# Altium schematic sheet TD.0002-100_1.SchDoc: ДТТ-1
size 420 x 297 mm; ApprovedBy: Маханов; CheckedBy: Айкеева; Organization: РЭТ-41; SheetNumber: 1; SheetTotal: 3; ProcessInspection: Айкеева; NormInspection: Мухамедрах.
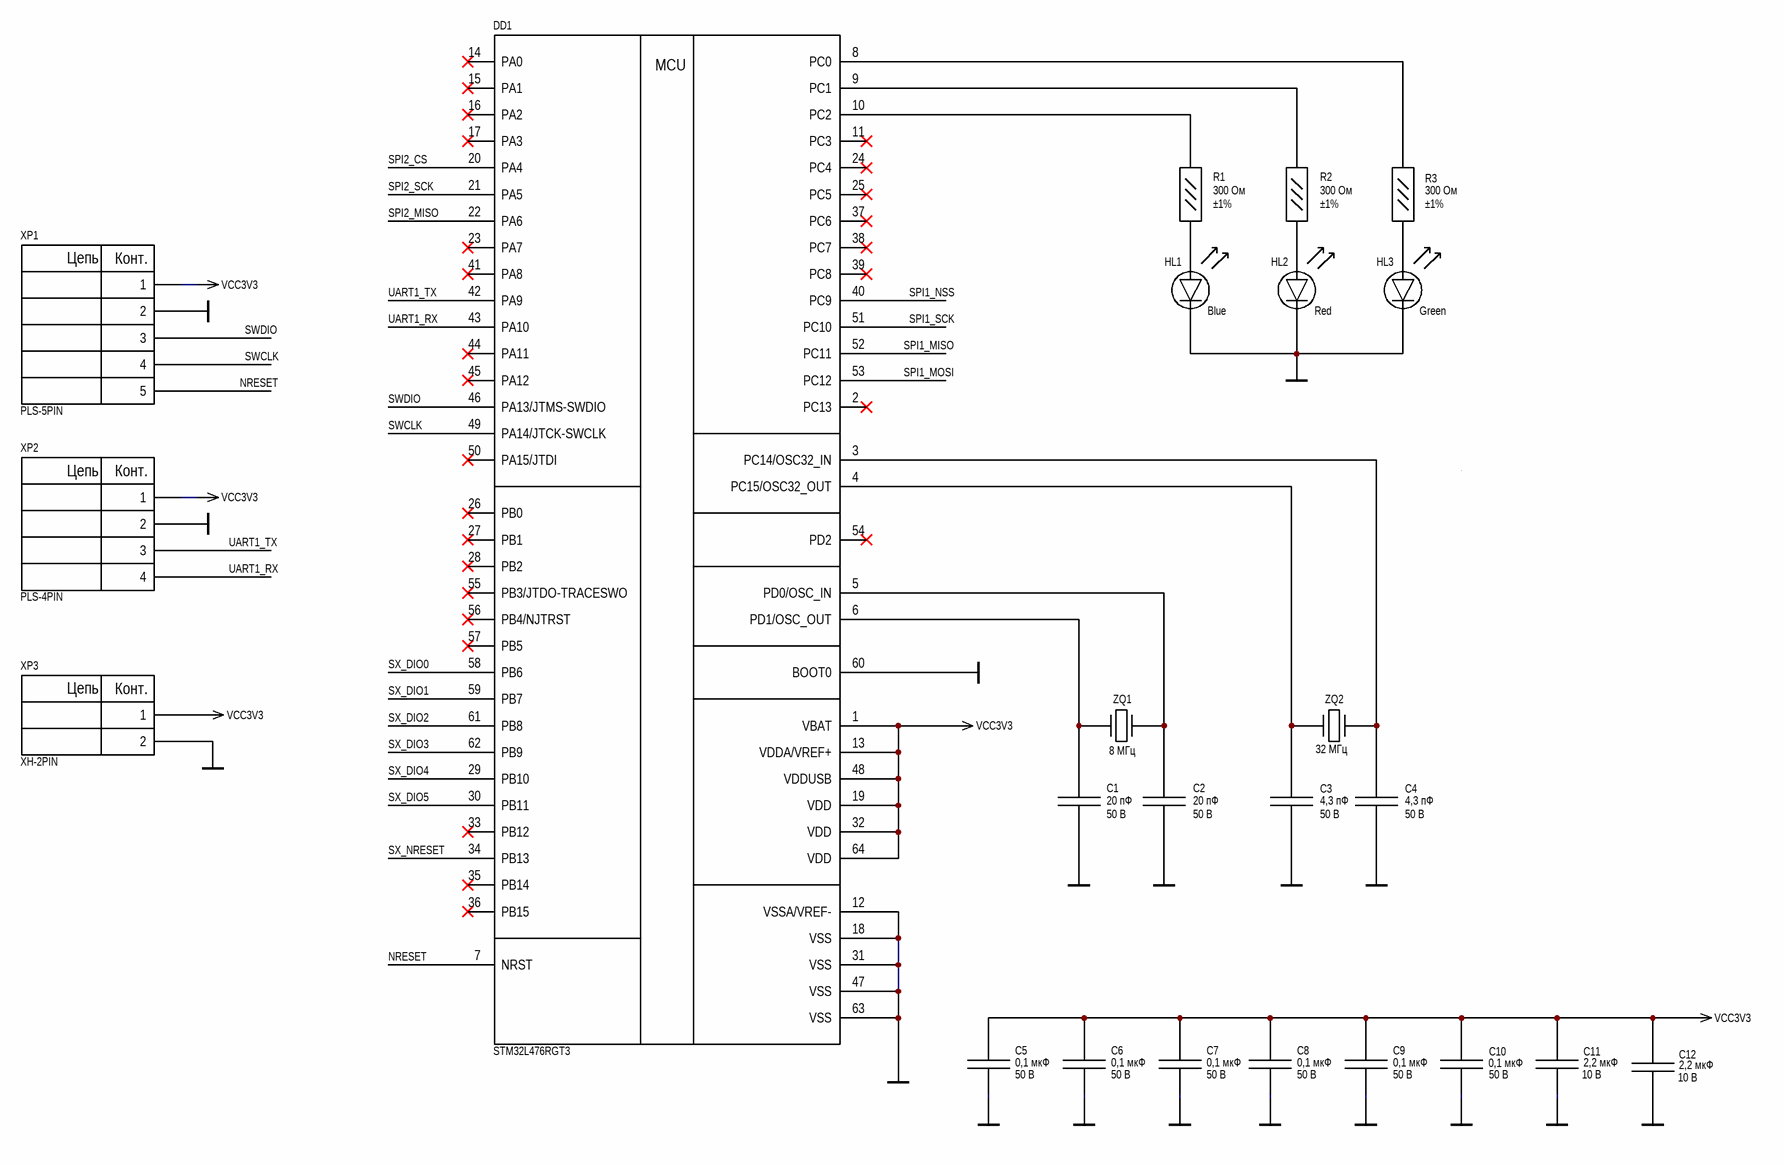
[diagram p0: TD.0002-100_1.SchDoc]

## Parts
C1  value 20 пФ  Voltage: 50 В  [C_0402]  (hidden comment: GCM1555C1H200JA16)
C2  value 20 пФ  Voltage: 50 В  [C_0402]  (hidden comment: GCM1555C1H200JA16)
C3  value 4,3 пФ  Voltage: 50 В  [C_0402]  (hidden comment: GCM1555C1H4R3BA16)
C4  value 4,3 пФ  Voltage: 50 В  [C_0402]  (hidden comment: GCM1555C1H4R3BA16)
C5  value 0,1 мкФ  Voltage: 50 В  [C_0402]  (hidden comment: GRM155R71H104KE14)
C6  value 0,1 мкФ  Voltage: 50 В  [C_0402]  (hidden comment: GRM155R71H104KE14)
C7  value 0,1 мкФ  Voltage: 50 В  [C_0402]  (hidden comment: GRM155R71H104KE14)
C8  value 0,1 мкФ  Voltage: 50 В  [C_0402]  (hidden comment: GRM155R71H104KE14)
C9  value 0,1 мкФ  Voltage: 50 В  [C_0402]  (hidden comment: GRM155R71H104KE14)
C10  value 0,1 мкФ  Voltage: 50 В  [C_0402]  (hidden comment: GRM155R71H104KE14)
C11  value 2,2 мкФ  Voltage: 10 В  [C_0402]  (hidden comment: GRM155C81A225ME44)
C12  value 2,2 мкФ  Voltage: 10 В  [C_0402]  (hidden comment: GRM155C81A225ME44)
DD1  STM32L476RGT3  [LQFP_64]
HL1  Color: Blue  [LED_0805_BLUE]  (hidden comment: TO-2013BC-BF)
HL2  Color: Red  [LED_0805_RED]  (hidden comment: TO-2013BC-MRE)
HL3  Color: Green  [LED_0805_GREEN]  (hidden comment: TO-2013BC-PG)
R1  value 300 Ом  Accuracy: ±1%  [R_0402]  (hidden comment: RC0100FR-07300RP)
R2  value 300 Ом  Accuracy: ±1%  [R_0402]  (hidden comment: RC0100FR-07300RP)
R3  value 300 Ом  Accuracy: ±1%  [R_0402]  (hidden comment: RC0100FR-07300RP)
XP1  PLS-5PIN  [PLS-5PIN]
XP2  PLS-4PIN  [PLS-4PIN]
XP3  XH-2PIN  [XH-2PIN]
ZQ1  value 8 МГц  [CM9V-T1A]  (hidden comment: Quartz)
ZQ2  value 32 МГц  [CM9V-T1A]  (hidden comment: Quartz)

## Nets
GND: C1.2 C2.2 C3.2 C4.2 C5.2 C6.2 C7.2 C8.2 C9.2 C10.2 C11.2 C12.2 DD1.12(VSSA/VREF-) DD1.18(VSS) DD1.31(VSS) DD1.47(VSS) DD1.60(BOOT0) DD1.63(VSS) HL1.2 HL2.2 HL3.2 XP1.2 XP2.2 XP3.2
VCC3V3: C5.1 C6.1 C7.1 C8.1 C9.1 C10.1 C11.1 C12.1 DD1.1(VBAT) DD1.13(VDDA/VREF+) DD1.19(VDD) DD1.32(VDD) DD1.48(VDDUSB) DD1.64(VDD) XP1.1 XP2.1 XP3.1
NRESET: DD1.7(NRST) XP1.5
SPI1_MISO: DD1.52(PC11)
SPI1_MOSI: DD1.53(PC12)
SPI1_NSS: DD1.40(PC9)
SPI1_SCK: DD1.51(PC10)
SPI2_CS: DD1.20(PA4)
SPI2_MISO: DD1.22(PA6)
SPI2_SCK: DD1.21(PA5)
SWCLK: DD1.49(PA14/JTCK-SWCLK) XP1.4
SWDIO: DD1.46(PA13/JTMS-SWDIO) XP1.3
SX_DIO0: DD1.58(PB6)
SX_DIO1: DD1.59(PB7)
SX_DIO2: DD1.61(PB8)
SX_DIO3: DD1.62(PB9)
SX_DIO4: DD1.29(PB10)
SX_DIO5: DD1.30(PB11)
SX_NRESET: DD1.34(PB13)
UART1_RX: DD1.43(PA10) XP2.4
UART1_TX: DD1.42(PA9) XP2.3
NetC1_1: C1.1 DD1.6(PD1/OSC_OUT) ZQ1.2(XO)
NetC2_1: C2.1 DD1.5(PD0/OSC_IN) ZQ1.1(XI)
NetC3_1: C3.1 DD1.4(PC15/OSC32_OUT) ZQ2.1(XI)
NetC4_1: C4.1 DD1.3(PC14/OSC32_IN) ZQ2.2(XO)
NetDD1_8: DD1.8(PC0) R3.2
NetDD1_9: DD1.9(PC1) R2.2
NetDD1_10: DD1.10(PC2) R1.2
NetHL1_1: HL1.1 R1.1
NetHL2_1: HL2.1 R2.1
NetHL3_1: HL3.1 R3.1

Not connected (* = marked no-connect by the designer): DD1 2(PC13)* 11(PC3)* 14(PA0)* 15(PA1)* 16(PA2)* 17(PA3)* 23(PA7)* 24(PC4)* 25(PC5)* 26(PB0)* 27(PB1)* 28(PB2)* 33(PB12)* 35(PB14)* 36(PB15)* 37(PC6)* 38(PC7)* 39(PC8)* 41(PA8)* 44(PA11)* 45(PA12)* 50(PA15/JTDI)* 54(PD2)* 55(PB3/JTDO-TRACESWO)* 56(PB4/NJTRST)* 57(PB5)*

## Notes on the sheet
- Перв. примен.
- Справ. №
- Подп. и дата
- Инв. № дубл.
- Взам. инв. №
- Изм.
- Лист
- № докум.
- Подп.
- Дата
- Лит.
- Масса
- Масштаб
- Т.контр.
- Пров.
- Разраб.
- Листов
- Инв. № подл.
- Н.контр.
- Утв.
- Копировал
- Формат А3
- (in symbol PLS-4PIN) Цепь; Конт.
- (in symbol PLS-5PIN) Цепь; Конт.
- (in symbol STM32L476RGT3) MCU
- (in symbol XH-2PIN) Цепь; Конт.

## Library data of the parts
C1 C2 = GCM1555C1H200JA16: Chip Multilayer Ceramic Capacitor; Manufacturer: Murata; TC: C0G; Tolerance: ±5%; Type: Конденсатор керамический; Operating temperature: -55 … 125 °C; Part Number: GCM1555C1H200JA16; Library Ref: *; Library Path: *; Package: SMD 0402; Temperature coefficient: *
C3 C4 = GCM1555C1H4R3BA16: Chip Multilayer Ceramic Capacitor; Manufacturer: Murata; TC: C0G; Tolerance: ±0,1 пФ; Type: Конденсатор керамический; Operating temperature: -55 … 125 °C; Part Number: GCM1555C1H4R3BA16; Library Ref: *; Library Path: *; Package: SMD 0402; Temperature coefficient: *
C5-C10 = GRM155R71H104KE14: Chip Multilayer Ceramic Capacitor; Manufacturer: Murata; TC: X7R; Tolerance: ±10%; Type: Конденсатор керамический; Operating temperature: -55 … 125 °C; Part Number: GRM155R71H104KE14; Library Ref: *; Library Path: *; Package: SMD 0402; Temperature coefficient: *
C11 C12 = GRM155C81A225ME44: Chip Multilayer Ceramic Capacitor; Manufacturer: Murata; TC: X6S; Tolerance: ±20%; Type: Конденсатор керамический; Operating temperature: -55 … 105 °C; Part Number: GRM155C81A225ME44; Library Ref: *; Library Path: *; Package: SMD 0402; Temperature coefficient: *
DD1 = STM32L476RGT3: Manufacturer: STMicroelectronics; Supply voltage: 1,71 ... 3,6 V; SRAM: 1 KB; Flash memory: 1 MB; Cystal oscillator: 4 ... 48 MHz; Type: Microcontroller; Temperature range: -40 ... +125 ºC
HL1 = TO-2013BC-BF: Светодиод синий; Manufacturer: OASISTEK; Value: 20 мА; Wavelength: 468 нм; Type: SMD; Part Number: TO-2013BC-BF; Package: SMD 0805
HL2 = TO-2013BC-MRE: Светодиод красный; Manufacturer: OASISTEK; Value: 20 мА; Wavelength: 630 нм; Type: SMD; Part Number: TO-2013BC-MRE; Package: SMD 0805
HL3 = TO-2013BC-PG: Светодиод зеленый; Manufacturer: OASISTEK; Value: 20 мА; Wavelength: 525 нм; Type: SMD; Part Number: TO-2013BC-PG; Package: SMD 0805
R1-R3 = RC0100FR-07300RP: General Purpose; Manufacturer: Yageo; Voltage: 15 В; Power dissipation: *; Part Number: RC0100FR-07300RP; Package: SMD 0402; Operating temperature: -55 … 125 °C; Type: Толстопленочный
XP1 = PLS-5PIN: Contact step: 2,54 mm
XP2 = PLS-4PIN: Contact step: 2,54 mm
XP3 = XH-2PIN: Manufaturer: JST; Voltage: 250 V; Current: 3 A; Contact step: 2,54 mm; Type: Connector